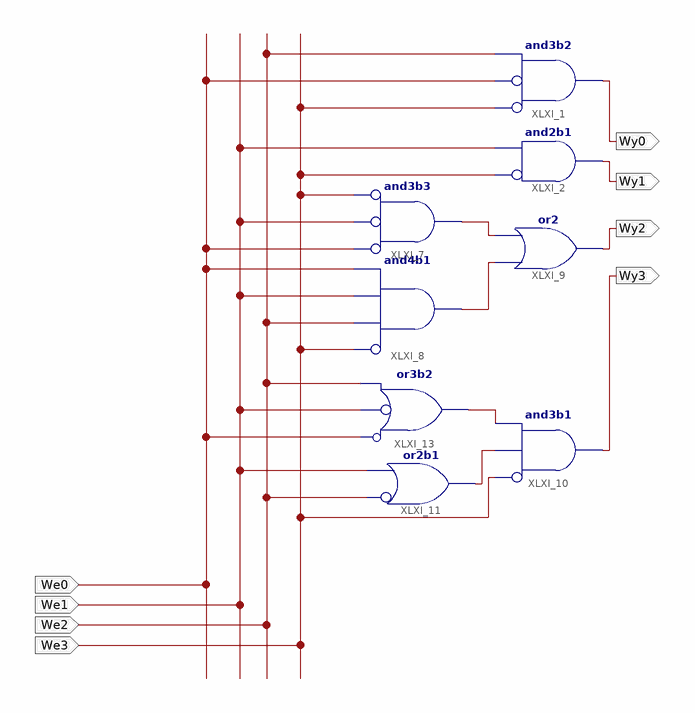
[diagram p0: schematic sheet 1]
// Xilinx ISE schematic dekoder_D1.sch (spartan3e) as structural Verilog: 8 symbols, 8 ports
module dekoder_D1 (
  input  We0,
  input  We1,
  input  We2,
  input  We3,
  output Wy0,
  output Wy1,
  output Wy2,
  output Wy3
);

  wire XLXN_19, XLXN_20, XLXN_21, XLXN_22;

  and XLXI_1 (Wy0, ~We3, ~We0, We2);  // and3b2
  and XLXI_2 (Wy1, ~We3, We1);  // and2b1
  or XLXI_9 (Wy2, XLXN_20, XLXN_19);
  and XLXI_8 (XLXN_20, ~We3, We2, We1, We0);  // and4b1
  and XLXI_7 (XLXN_19, ~We0, ~We1, ~We3);  // and3b3
  or XLXI_11 (XLXN_22, ~We2, We1);  // or2b1
  or XLXI_13 (XLXN_21, ~We0, ~We1, We2);  // or3b2
  and XLXI_10 (Wy3, ~We3, XLXN_22, XLXN_21);  // and3b1
endmodule
